# Altium schematic sheet MCU.SchDoc
size A
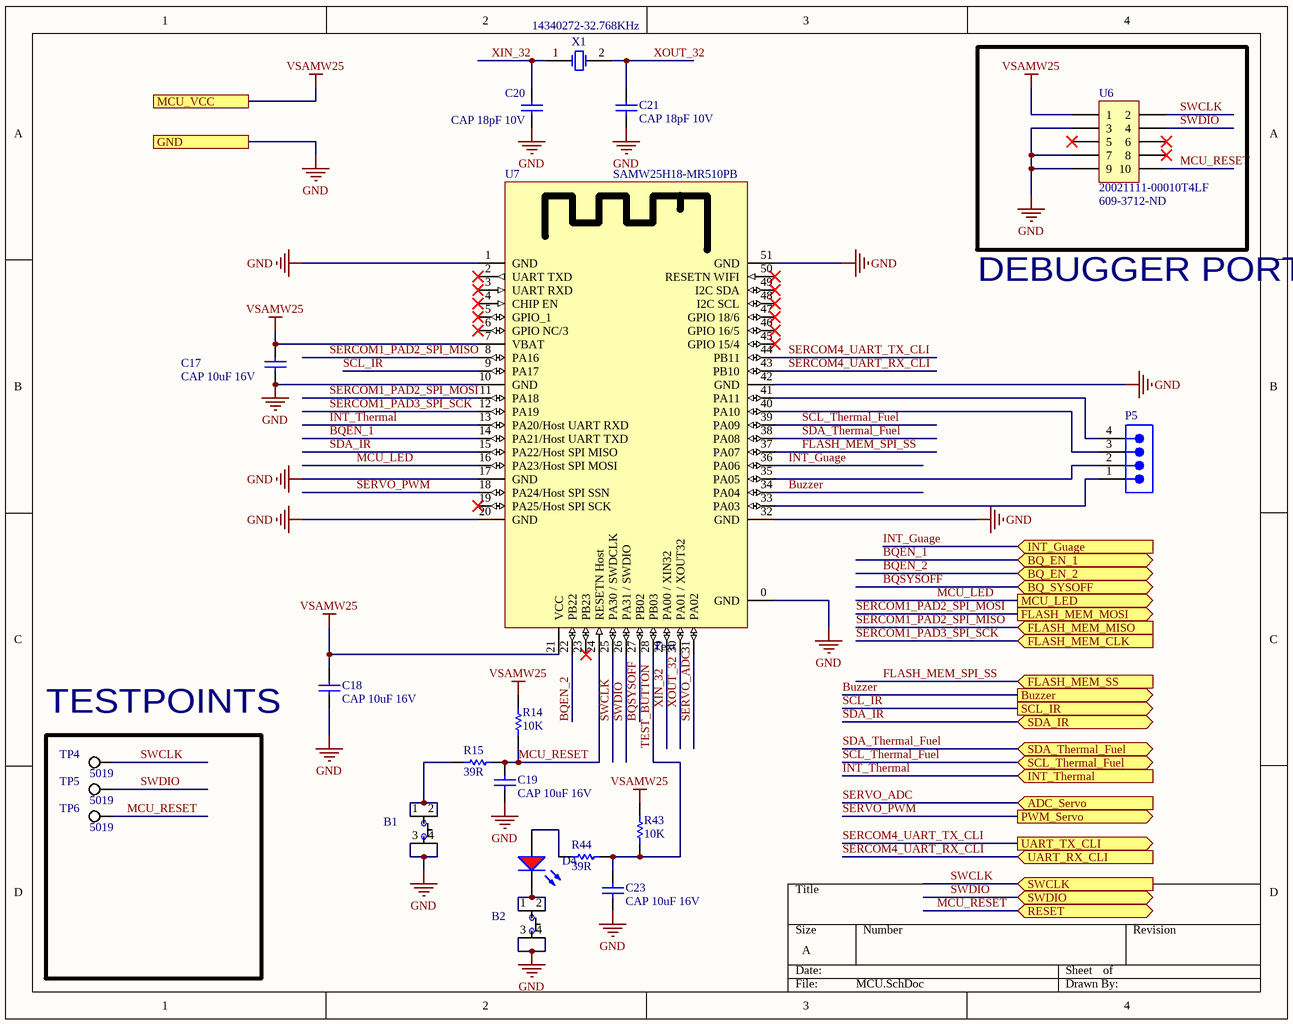
[diagram p0: MCU.SchDoc]

## Parts
B1  PTS810 SJK 250 SMTR LFS  [PTS810 SJK 250 SMTR LFS]  (value not drawn)
B2  PTS810 SJK 250 SMTR LFS  [PTS810 SJK 250 SMTR LFS]  (value not drawn)
C17  CAP 10uF 16V  [CAPC0805(2012)145_L]
C18  CAP 10uF 16V  [CAPC0805(2012)145_L]
C19  CAP 10uF 16V  [CAPC0805(2012)145_L]
C20  CAP 18pF 10V  [CAPC0805(2012)75_L]
C21  CAP 18pF 10V  [CAPC0805(2012)75_L]
C23  CAP 10uF 16V  [CAPC0805(2012)145_L]
D4  (no value)  [LTST-C170CKT_V]
P5  (no value)  [SMTC-MTSW-104-07-X-S-170]
R14  10K  [RESC0402(1005)_M]
R15  39R  [RESC0805(2012)_N]
R43  10K  [RESC0402(1005)_M]
R44  39R  [RESC0805(2012)_N]
TP4  5019  [KSTN-5019_V]
TP5  5019  [KSTN-5019_V]
TP6  5019  [KSTN-5019_V]
U6  20021111-00010T4LF  Supplier Part Number 1: 609-3712-ND  [20021111-00010T4LF]
U7  SAMW25H18-MR510PB  [SAMW25H18-MR510PB]
X1  14340272-32.768KHz  [ITTI-14340272-32.768KHz-2_V]

## Blocks framed on the sheet
TESTPOINTS: TP4-TP6

## Ports
ADC_Servo (in), BQ_EN_1 (bidir), BQ_EN_2 (bidir), BQ_SYSOFF (bidir), Buzzer (out), FLASH_MEM_CLK (in), FLASH_MEM_MISO (in), FLASH_MEM_MOSI (out), FLASH_MEM_SS (in), GND, INT_Guage (in), INT_Thermal (in), MCU_LED (out), MCU_VCC, PWM_Servo (out), RESET (bidir), SCL_IR (out), SCL_Thermal_Fuel (bidir), SDA_IR (bidir), SDA_Thermal_Fuel (bidir), SWCLK (in), SWDIO (bidir), UART_RX_CLI (in), UART_TX_CLI (out)

## Nets
GND: B1.3 B1.4 B2.3 B2.4 C17.1 C18.1 C19.1 C20.2 C21.2 C23.1 U6.3 U6.7 U6.9 U7.0(GND) U7.1(GND) U7.10(GND) U7.17(GND) U7.20(GND) U7.32(GND) U7.42(GND) U7.51(GND) ; port GND
VSAMW25: C17.2 C18.2 R14.1 R43.1 U6.1 U7.7(VBAT) U7.21(VCC) ; port MCU_VCC
BQEN_1: U7.14(PA21/Host_UART_TXD) ; port BQ_EN_1
BQEN_2: U7.22(PB22) ; port BQ_EN_2
BQSYSOFF: U7.27(PB02) ; port BQ_SYSOFF
Buzzer: U7.34(PA04) ; port Buzzer
FLASH_MEM_SPI_SS: U7.37(PA07) ; port FLASH_MEM_SS
INT_Guage: U7.36(PA06) ; port INT_Guage
INT_Thermal: U7.13(PA20/Host_UART_RXD) ; port INT_Thermal
MCU_LED: U7.16(PA23/Host_SPI_MOSI) ; port MCU_LED
MCU_RESET: C19.2 R14.2 R15.1 TP6.1 U6.10 U7.24(RESETN_Host) ; port RESET
SCL_IR: U7.9(PA17) ; port SCL_IR
SCL_Thermal_Fuel: U7.39(PA09) ; port SCL_Thermal_Fuel
SDA_IR: U7.15(PA22/Host_SPI_MISO) ; port SDA_IR
SDA_Thermal_Fuel: U7.38(PA08) ; port SDA_Thermal_Fuel
SERCOM1_PAD2_SPI_MISO: U7.8(PA16) ; port FLASH_MEM_MISO
SERCOM1_PAD2_SPI_MOSI: U7.11(PA18) ; port FLASH_MEM_MOSI
SERCOM1_PAD3_SPI_SCK: U7.12(PA19) ; port FLASH_MEM_CLK
SERCOM4_UART_RX_CLI: U7.43(PB10) ; port UART_RX_CLI
SERCOM4_UART_TX_CLI: U7.44(PB11) ; port UART_TX_CLI
SERVO_ADC: U7.31(PA02) ; port ADC_Servo
SERVO_PWM: U7.18(PA24/Host_SPI_SSN) ; port PWM_Servo
SWCLK: TP4.1 U6.2 U7.25(PA30_/_SWDCLK) ; port SWCLK
SWDIO: TP5.1 U6.4 U7.26(PA31_/_SWDIO) ; port SWDIO
TEST_BUTTON: C23.2 R43.2 R44.1 U7.28(PB03)
XIN_32: C20.1 U7.29(PA00_/_XIN32) X1.1(X1)
XOUT_32: C21.1 U7.30(PA01_/_XOUT32) X1.2(X2)
NetB1_1: B1.1 B1.2 R15.2
NetB2_1: B2.1 B2.2 D4.C
NetD4_A: D4.A R44.2
NetP5_1: P5.1 U7.33(PA03)
NetP5_2: P5.2 U7.35(PA05)
NetP5_3: P5.3 U7.40(PA10)
NetP5_4: P5.4 U7.41(PA11)

Not connected (* = marked no-connect by the designer): U6 5* 6* 8*; U7 2(UART_TXD)* 3(UART_RXD)* 4(CHIP_EN)* 5(GPIO_1)* 6(GPIO_NC/3)* 19(PA25/Host_SPI_SCK)* 23(PB23)* 45(GPIO_15/4)* 46(GPIO_16/5)* 47(GPIO_18/6)* 48(I2C_SCL)* 49(I2C_SDA)* 50(RESETN_WIFI)*

## Notes on the sheet
- DEBUGGER PORT
- (near U7) Text

## Library data of the parts
B1 B2 = PTS810 SJK 250 SMTR LFS: SWITCH TACTILE SPST-NO 0.05A 16V Tactile Switch SPST-NO Top Actuated Surface Mount; Manufacturer: ITT /  C&K Components; Part # Aliases: Y97LT25B5DBFP; Operating Force: 2.6 N; Actuator: Oval; Current Rating: 50 mA; Voltage Rating DC: 16 VDC; Contact Form: SPST; Switch Function: OFF - (ON); Mounting Direction: Straight; Stem Height: 2.5 mm; Brand: C&K Components; Travel: 0.15 mm; Manufacturer Part Number: PTS810SJK250SMTRLFS; Product Category: Tactile Switches; RoHS: Details; Termination Style: J Form Lead; Mounting Style: SMD/SMT; Color: White; Packaging: Reel; Contact Plating: Silver; Operating Temperature Range: - 40 C to + 85 C; Series: PTS810; Factory Pack Quantity: 2900; ComponentLink1URL: https://datasheet.ciiva.com/18514/pts810-4mar13-18514061.pdf; ComponentLink1Description: https://datasheet.ciiva.com/18514/pts810-4mar13-18514061.pdf; ComponentLink2URL: https://datasheet.ciiva.com/18514/pts810-4mar13-18514062.pdf; ComponentLink2Description: https://datasheet.ciiva.com/18514/pts810-4mar13-18514062.pdf; ComponentLink3URL: https://datasheet.ciiva.com/18514/pts810-4mar13-18514063.pdf; ComponentLink3Description: https://datasheet.ciiva.com/18514/pts810-4mar13-18514063.pdf; Supplier 1: Digi-Key; Supplier Part Number 1: CKN10503CT-ND
C17-C19 C23 = CMP-1036-04927-1: CAP 10uF 16V ±10% 0805 (2012 Metric) Thickness 1.45mm SMD; Case-EIA: 0805; Tolerance: Â±10%; Case-Metric: 2012; Rated Voltage: 16 V; Technology: SMT; Value: 10uF; Max Thickness: 1.45 mm
C20 C21 = CMP-1036-01106-1: CAP 18pF 10V ±1% 0805 (2012 Metric) Thickness 0.75mm SMD; Tolerance: Â±1%; Case-Metric: 2012; Case-EIA: 0805; Technology: SMT; Rated Voltage: 10 V; Value: 18pF; Max Thickness: 0.75 mm
D4 = CMP-1674-00001-3: LED RED CLEAR 0805 SMD; Manufacturer: Lite-On; PartNumber: LTST-C170CKT; PackageReference: C170CKT; ComponentLink1Description: Datasheet; ComponentLink1URL: http://media.digikey.com/pdf/Data%20Sheets/Lite-On%20PDFs/LTST-C170CKT.pdf
P5 = CMP-1024-00107-1: Manufacturer: Samtec; PartNumber: MTSW-104-07-L-S-170; Pitch: 2.54 mm; PackageVersion: BI, 2/1987; ComponentLink1URL: http://www.samtec.com; PackageReference: MTSW-104-07-X-S-170; ComponentLink3Description: Package Specification; Temperature Range: -55 to 125 degC; ComponentLink2URL: http://www.samtec.com/documents/webfiles/pdf/MTSW.PDF; RoHS: True; Orientation: Vertical; DatasheetVersion: F-214; Mounting Technology: Through-hole; ComponentLink1Description: Manufacturer URL; ComponentLink2Description: Datasheet; ComponentLink3URL: http://www.samtec.com/documents/webfiles/cpdf/MTSW-XXX-XX-X-X-XXXX-XX-XXX-MKT1.pdf
R14 R43 = CMP-1011-00098-1: 10K 0.063W 5% 0402 (1005 Metric)  SMD; Case-Metric: 1005; Value: 10000.00 Ohm; Case-EIA: 0402; Technology: SMT; Tolerance: 5 %; Power: 0.063 W
R15 R44 = CMP-1013-00040-1: 39R 0.125W 5% 0805 (2012 Metric)  SMD; Value: 39.00 Ohm; Case-EIA: 0805; Case-Metric: 2012; Technology: SMT; Power: 0.125 W; Tolerance: 5 %
TP4-TP6 = CMP-1672-00008-1: Test Point, 1 Position SMD, RoHS, Tape and Reel; ComponentLink1Description: Manufacturer URL; Package Quantity: 1000; DatasheetVersion: 03/2014; Packaging: Tape and Reel; ComponentLink2URL: http://www.keyelco.com/product-pdf.cfm?p=1357; ComponentLink1URL: http://www.keyelco.com/; Mount: Surface Mount; Contact Plating: Silver; PackageDescription: 1-Pin Surface Mount Device, Body 3.81 x 2.03 mm; Pins: 1; RoHSCompliant: True; Mounting Technology: Surface Mount; ComponentLink2Description: Datasheet; PackageReference: 5019
U6 = 20021111-00010T4LF: CONN HEADER 10POS UNSHD VERT T/H; Manufacturer: Amphenol / FCI; Stack Height: 2.5 mm; Number of Positions / Contacts: 10; Brand: FCI; Pitch: 1.27 mm; Mounting Angle: Vertical; Current Rating: 10 A; Mating Post Length: 3.05 mm; Voltage Rating: 125 V; Manufacturer Part Number: 20021111-00010T4LF; Mounting Style: Through Hole; Product Category: Headers & Wire Housings; RoHS: Details; Series: Minitek; Product Type: Headers; Type: Unshrouded; Number of Positions: 10; Number of Rows: 2; Contact Plating: Gold; Housing Material: Plastic; Termination Style: Through Hole; Contact Material: Nickel; Packaging: Tube; Factory Pack Quantity: 93; Termination Post Length: 2.3 mm; ComponentLink1URL: https://datasheet.ciiva.com/1433/1079612-1433267.pdf; ComponentLink1Description: https://datasheet.ciiva.com/1433/1079612-1433267.pdf; ComponentLink2URL: https://datasheet.ciiva.com/409/20021111-409158.pdf; ComponentLink2Description: https://datasheet.ciiva.com/409/20021111-409158.pdf; ComponentLink3URL: https://datasheet.ciiva.com/5131/20021111-5131386.pdf; ComponentLink3Description: https://datasheet.ciiva.com/5131/20021111-5131386.pdf; ComponentLink4URL: https://datasheet.ciiva.com/9465/20021111-9465402.pdf; ComponentLink4Description: https://datasheet.ciiva.com/9465/20021111-9465402.pdf; Supplier 1: Digi-Key
U7 = SAMW25H18-MR510PB: RF TXRX MODULE WIFI TRACE ANT; Manufacturer: Atmel; Manufacturer Part Number: ATSAMW25H18-MR510PB; Protocol: 802.11b/g/n; Frequency: 2.4GHz; Data Rate: 65Mbps; Power - Output: 17dBm; Sensitivity: -95.5dBm; Serial Interfaces: SPI, UART; Antenna Type: Integrated, Trace; Memory Size: 256kB Flash, 32kB SRAM; Voltage - Supply: 2.7 V ~ 4.2 V; Category: RF/IF and RFID; Family: RF Transceiver Modules; Series: Xplained Pro; Packaging: Tray; RF Family/Standard: WiFi; Modulation: -; Current - Receiving: -; Current - Transmitting: -; Mounting Type: Surface Mount; Operating Temperature: -40°C ~ 85°C; Package / Case: Module; ComponentLink1URL: http://www.atmel.com/devices/ATSAMW25.aspx; ComponentLink1Description: http://www.atmel.com/devices/ATSAMW25.aspx; ComponentLink2URL: http://www.farnell.com/datasheets/1965115.pdf; ComponentLink2Description: http://www.farnell.com/datasheets/1965115.pdf; Supplier 1: Digikey; Stock 1: 120; Pricing 1: 1=19.14 (USD); Supplier Part Number 1: ATSAMW25H18-MR510PB-ND
X1 = CMP-0463-00001-2: Crystal, 32.768 KHz, -40 to 85 degC, 3.2 x 1.5 x 0.9 mm SMD; Manufacturer: ITTI; Load Capacitance: 12.5 pF; Frequency Tolerance: +/-20 ppm; Drive Level: 1 max. uw; Nominal Frequency: 32.768KHz; Mounting Technology: Surface Mount; Operating temperature: -40 to 85 degC; PartNumber: 14340272-32.768KHz; ComponentLink1URL: http://www.itti-co.com; ComponentLink1Description: Manufacturer URL; PackageReference: 14340272-32.768KHz-2; PackageDescription: 2-Pin Hand Drawn, Body 3.2 x 1.5mm, Pitch 2.5 mm